# Altium project kbd_training.PrjPcb
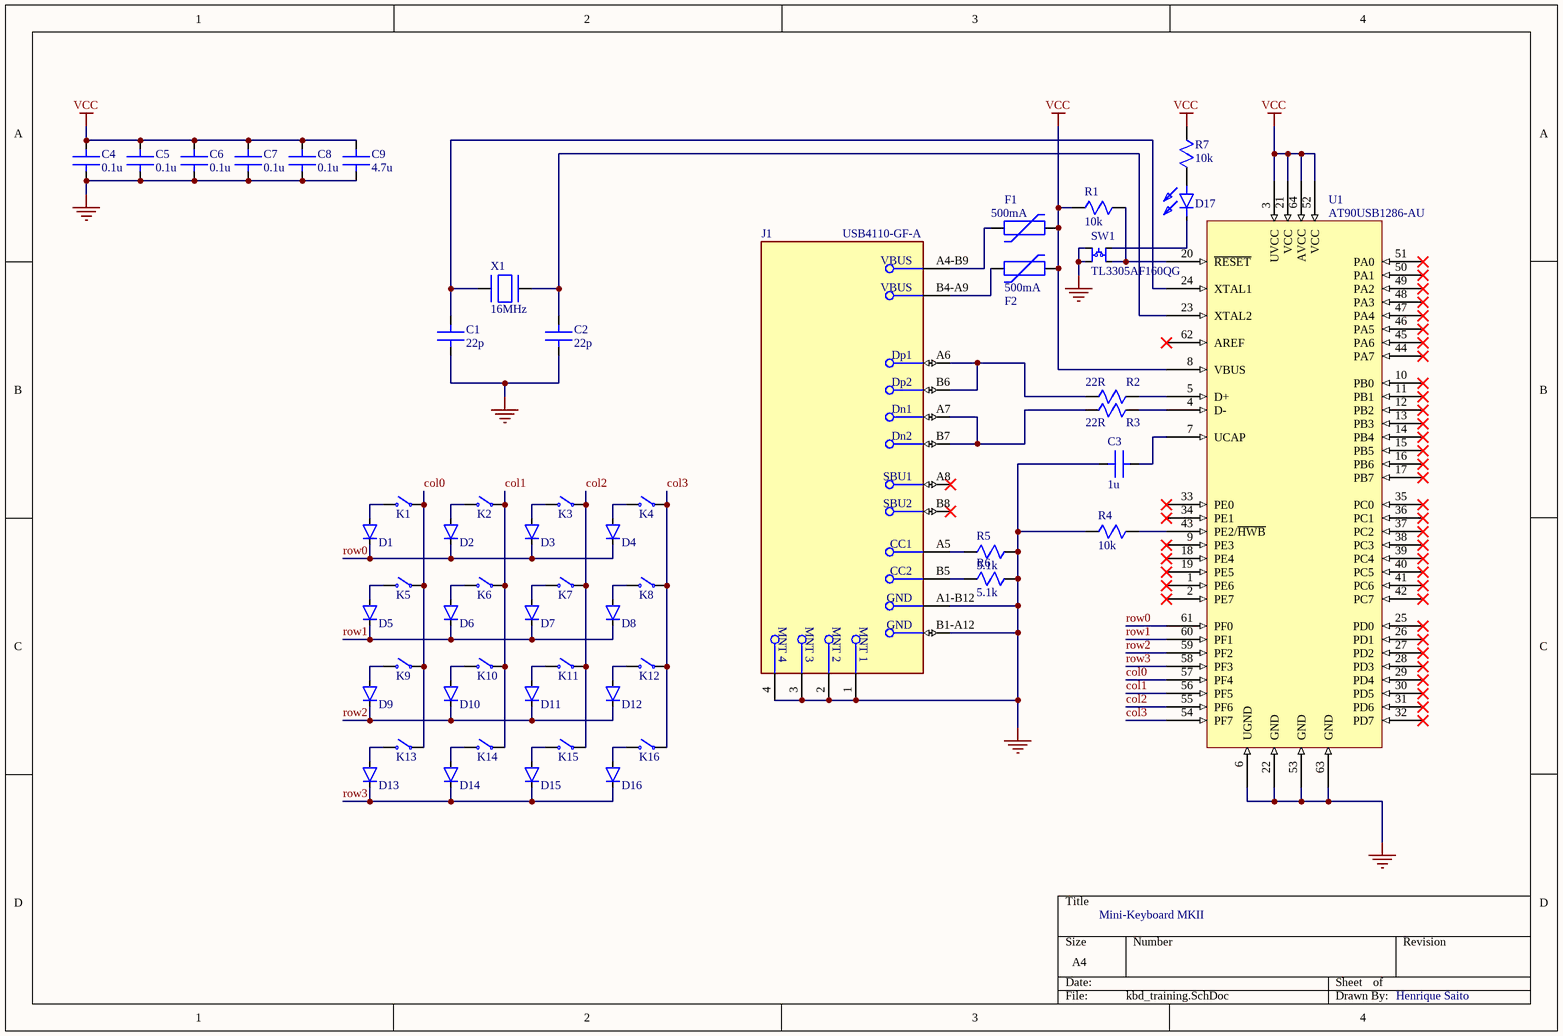
[diagram p0: kbd_training.SchDoc]
1 sheet, 55 parts. Net scope: global (net labels, ports and power ports of the same name join across sheets).
Board file: kbd_training.PcbDoc

## Sheet kbd_training.SchDoc
size A4; SheetNumber: 1; SheetTotal: 1

### Parts
C1  22p  [Cap0805]
C2  22p  [Cap0805]
C3  1u  [Cap0805]
C4  0.1u  [Cap0805]
C5  0.1u  [Cap0805]
C6  0.1u  [Cap0805]
C7  0.1u  [Cap0805]
C8  0.1u  [Cap0805]
C9  4.7u  [Cap0805]
D1  1N4148W-TP  [1N4 diode]  (value not drawn)
D2  1N4148W-TP  [1N4 diode]  (value not drawn)
D3  1N4148W-TP  [1N4 diode]  (value not drawn)
D4  1N4148W-TP  [1N4 diode]  (value not drawn)
D5  1N4148W-TP  [1N4 diode]  (value not drawn)
D6  1N4148W-TP  [1N4 diode]  (value not drawn)
D7  1N4148W-TP  [1N4 diode]  (value not drawn)
D8  1N4148W-TP  [1N4 diode]  (value not drawn)
D9  1N4148W-TP  [1N4 diode]  (value not drawn)
D10  1N4148W-TP  [1N4 diode]  (value not drawn)
D11  1N4148W-TP  [1N4 diode]  (value not drawn)
D12  1N4148W-TP  [1N4 diode]  (value not drawn)
D13  1N4148W-TP  [1N4 diode]  (value not drawn)
D14  1N4148W-TP  [1N4 diode]  (value not drawn)
D15  1N4148W-TP  [1N4 diode]  (value not drawn)
D16  1N4148W-TP  [1N4 diode]  (value not drawn)
D17  WP5603SIDLK/SD/J3  [MT5470EUR]  (value not drawn)
F1  500mA  [FUS0603]
F2  500mA  [FUS0603]
J1  USB4110-GF-A  [GCT_USB4110-GF-A_REVB]
K1  MX1A-11NN  [CHERRY_MX1A-11NN_SWITCH]  (value not drawn)
K2  MX1A-11NN  [CHERRY_MX1A-11NN_SWITCH]  (value not drawn)
K3  MX1A-11NN  [CHERRY_MX1A-11NN_SWITCH]  (value not drawn)
K4  MX1A-11NN  [CHERRY_MX1A-11NN_SWITCH]  (value not drawn)
K5  MX1A-11NN  [CHERRY_MX1A-11NN_SWITCH]  (value not drawn)
K6  MX1A-11NN  [CHERRY_MX1A-11NN_SWITCH]  (value not drawn)
K7  MX1A-11NN  [CHERRY_MX1A-11NN_SWITCH]  (value not drawn)
K8  MX1A-11NN  [CHERRY_MX1A-11NN_SWITCH]  (value not drawn)
K9  MX1A-11NN  [CHERRY_MX1A-11NN_SWITCH]  (value not drawn)
K10  MX1A-11NN  [CHERRY_MX1A-11NN_SWITCH]  (value not drawn)
K11  MX1A-11NN  [CHERRY_MX1A-11NN_SWITCH]  (value not drawn)
K12  MX1A-11NN  [CHERRY_MX1A-11NN_SWITCH]  (value not drawn)
K13  MX1A-11NN  [CHERRY_MX1A-11NN_SWITCH]  (value not drawn)
K14  MX1A-11NN  [CHERRY_MX1A-11NN_SWITCH]  (value not drawn)
K15  MX1A-11NN  [CHERRY_MX1A-11NN_SWITCH]  (value not drawn)
K16  MX1A-11NN  [CHERRY_MX1A-11NN_SWITCH]  (value not drawn)
R1  10k  [Res0805]
R2  22R  [Res0805]
R3  22R  [Res0805]
R4  10k  [Res0805]
R5  5.1k  [Res0805]
R6  5.1k  [Res0805]
R7  10k  [Res0805]
SW1  TL3305AF160QG  [TL3305 SW]
U1  AT90USB1286-AU  [QFP80P1600X1600X120-64N]
X1  16MHz  [xtal-m403]

### Nets
GND: C1.2 C2.2 C3.1 C4.1 C5.1 C6.1 C7.1 C8.1 C9.1 J1.1(MNT_1) J1.2(MNT_2) J1.3(MNT_3) J1.4(MNT_4) J1.A1-B12(GND) J1.B1-A12(GND) R4.1 R5.2 R6.2 SW1.3 SW1.4 U1.6(UGND) U1.22(GND) U1.53(GND) U1.63(GND)
VCC: C4.2 C5.2 C6.2 C7.2 C8.2 C9.2 F1.2 F2.2 R1.1 R7.2 U1.3(UVCC) U1.8(VBUS) U1.21(VCC) U1.52(VCC) U1.64(AVCC)
col0: K1.2 K5.2 K9.2 K13.2 U1.57(PF4)
col1: K2.2 K6.2 K10.2 K14.2 U1.56(PF5)
col2: K3.2 K7.2 K11.2 K15.2 U1.55(PF6)
col3: K4.2 K8.2 K12.2 K16.2 U1.54(PF7)
row0: D1.2 D2.2 D3.2 D4.2 U1.61(PF0)
row1: D5.2 D6.2 D7.2 D8.2 U1.60(PF1)
row2: D9.2 D10.2 D11.2 D12.2 U1.59(PF2)
row3: D13.2 D14.2 D15.2 D16.2 U1.58(PF3)
NetC1_1: C1.1 U1.24(XTAL1) X1.1
NetC2_1: C2.1 U1.23(XTAL2) X1.3
NetC3_2: C3.2 U1.7(UCAP)
NetD1_1: D1.1 K1.1
NetD2_1: D2.1 K2.1
NetD3_1: D3.1 K3.1
NetD4_1: D4.1 K4.1
NetD5_1: D5.1 K5.1
NetD6_1: D6.1 K6.1
NetD7_1: D7.1 K7.1
NetD8_1: D8.1 K8.1
NetD9_1: D9.1 K9.1
NetD10_1: D10.1 K10.1
NetD11_1: D11.1 K11.1
NetD12_1: D12.1 K12.1
NetD13_1: D13.1 K13.1
NetD14_1: D14.1 K14.1
NetD15_1: D15.1 K15.1
NetD16_1: D16.1 K16.1
NetD17_1: D17.1 SW1.2
NetD17_2: D17.2 R7.1
NetF1_1: F1.1 J1.A4-B9(VBUS)
NetF2_1: F2.1 J1.B4-A9(VBUS)
NetJ1_A5: J1.A5(CC1) R5.1
NetJ1_A6: J1.A6(Dp1) J1.B6(Dp2) R2.1
NetJ1_A7: J1.A7(Dn1) J1.B7(Dn2) R3.1
NetJ1_B5: J1.B5(CC2) R6.1
NetR1_2: R1.2 SW1.1 U1.20(~{RESET})
NetR2_2: R2.2 U1.5(D+)
NetR3_2: R3.2 U1.4(D-)
NetR4_2: R4.2 U1.43(PE2/~{HWB})

Not connected (* = marked no-connect by the designer): J1 A8(SBU1)* B8(SBU2)*; U1 1(PE6)* 2(PE7)* 9(PE3)* 10(PB0)* 11(PB1)* 12(PB2)* 13(PB3)* 14(PB4)* 15(PB5)* 16(PB6)* 17(PB7)* 18(PE4)* 19(PE5)* 25(PD0)* 26(PD1)* 27(PD2)* 28(PD3)* 29(PD4)* 30(PD5)* 31(PD6)* 32(PD7)* 33(PE0)* 34(PE1)* 35(PC0)* 36(PC1)* 37(PC2)* 38(PC3)* 39(PC4)* 40(PC5)* 41(PC6)* 42(PC7)* 44(PA7)* 45(PA6)* 46(PA5)* 47(PA4)* 48(PA3)* 49(PA2)* 50(PA1)* 51(PA0)* 62(AREF)*

### Notes on the sheet
- Mini-Keyboard MKII
- Henrique Saito

### Library data of the parts
C1 C2 = C0805C220J5GACTU: Cap Ceramic 22pF 50V C0G 5% SMD 0805 125C Plastic T/R; Manufacturer: KEMET; Temperature Coefficient: 30ppm/°C; Supplier 1: Digi-Key; Manufacturer Part Number: C0805C220J5GACTU; RoHS: Yes; Category: Ceramic Capacitors; Stock 1: 630269; Pricing 1: 1=0.10000, 10=0.06000, 50=0.03300, 100=0.02700, 500=0.01924, 1000=0.01512 (USD); Mount: PCB,Surface Mount; Case/Package: 0805; Case Code (Metric): 2012; Case Code (Imperial): 0805; Weight: 0.000194oz; Contact Material: Tin; Contact Plating: Tin,Matte; Dielectric Material: Ceramic; Min Operating Temperature: -55°C; Max Operating Temperature: 125°C; Packaging: Tape and Reel; Capacitance: 22pF; Tolerance: 5%; Package Quantity: 1; Voltage Rating: 50V; Voltage Rating (DC): 50V; Dielectric: C0G; Termination: SMD/SMT; Voltage: 50V; Series: C0805C; Construction: Flat; Length: 2mm; Width: 1.25mm; Height: 0.78mm; Thickness: 0.035inch; Depth: 1.25mm; Radiation Hardening: No; REACH SVHC: No SVHC; Lead Free: Lead Free; ComponentLink1URL: https://datasheet.ciiva.com/7842/1732694-7842250.pdf?src-supplier=Element14; ComponentLink1Description: https://datasheet.ciiva.com/7842/1732694-7842250.pdf?src-supplier=Element14; ComponentLink2URL: https://datasheet.ciiva.com/7842/1372242-7842570.pdf?src-supplier=Element14; ComponentLink2Description: https://datasheet.ciiva.com/7842/1372242-7842570.pdf?src-supplier=Element14; ComponentLink3URL: https://datasheet.ciiva.com/7842/1732694-7842251.pdf?src-supplier=Element14; ComponentLink3Description: https://datasheet.ciiva.com/7842/1732694-7842251.pdf?src-supplier=Element14; ComponentLink4URL: https://datasheet.ciiva.com/7842/kem-c1003-c0g-smd-7842569.pdf?src-supplier=Element14; ComponentLink4Description: https://datasheet.ciiva.com/7842/kem-c1003-c0g-smd-7842569.pdf?src-supplier=Element14; ComponentLink5URL: https://datasheet.ciiva.com/28668/1789732-28668761.pdf?src-supplier=Element14; ComponentLink5Description: https://datasheet.ciiva.com/28668/1789732-28668761.pdf?src-supplier=Element14; Supplier Part Number 1: 399-C0805C220J5GAC7800CT-ND
C3 = 885012207051: Cap, 1ΜF, 16V, 10%, X7R, 0805; Manufacturer: Wurth Electronics; Capacitance: 1uF; Supplier 1: Digi-Key; Manufacturer Part Number: 885012207051; RoHS: Yes; Category: Ceramic Capacitors; Stock 1: 58540; Pricing 1: 1=0.10000, 10=0.08200, 100=0.07400, 500=0.06500 (USD); Mount: Surface Mount; Case/Package: 0805; Case Code (Metric): 2012; Case Code (Imperial): 0805; Min Operating Temperature: -55°C; Max Operating Temperature: 125°C; Packaging: Tape and Reel; Voltage Rating: 16V; Tolerance: 10%; Length: 0.079inch; Width: 0.049inch; Thickness: 0.053inch; RoHS Compliant: Yes; ComponentLink1URL: http://www.farnell.com/datasheets/2031863.pdf?src-supplier=Farnell; ComponentLink1Description: http://www.farnell.com/datasheets/2031863.pdf?src-supplier=Farnell; ComponentLink2URL: http://www.farnell.com/datasheets/2031863.pdf?src-supplier=Newark; ComponentLink2Description: http://www.farnell.com/datasheets/2031863.pdf?src-supplier=Newark; ComponentLink3URL: http://www.farnell.com/datasheets/2031863.pdf?src-supplier=Element14; ComponentLink3Description: http://www.farnell.com/datasheets/2031863.pdf?src-supplier=Element14; ComponentLink4URL: https://katalog.we-online.de/pbs/datasheet/885012207051.pdf?src-supplier=Digi-Key; ComponentLink4Description: https://katalog.we-online.de/pbs/datasheet/885012207051.pdf?src-supplier=Digi-Key; Supplier Part Number 1: 732-7664-1-ND
C4-C8 = CC0805ZRY5V9BB104: Cap Ceramic 0.1uF 50V Y5V -20% to 80% SMD 0805 85C T/R; Manufacturer: Yageo; Capacitance: 100nF; Supplier 1: Digi-Key; Manufacturer Part Number: CC0805ZRY5V9BB104; RoHS: Yes; Category: Ceramic Capacitors; Stock 1: 957069; Pricing 1: 1=0.10000, 10=0.06700, 50=0.03640, 100=0.02960, 500=0.02118, 1000=0.01664 (USD); Mount: Surface Mount; Case/Package: 0805; Number of Pins: 2; Case Code (Metric): 2012; Case Code (Imperial): 0805; Material: Ceramic; Dielectric Material: Ceramic; Min Operating Temperature: -30°C; Max Operating Temperature: 85°C; Package Quantity: 1; Voltage Rating: 50V; Tolerance: 80%; Packaging: Tape and Reel; Voltage Rating (DC): 50V; Dielectric: Y5V; Termination: SMD/SMT; Resistor Type: Ceramic; Series: CC; Construction: Flat; Length: 2mm; Width: 0.049inch; Height: 0.6mm; Thickness: 0.024inch; Depth: 1.25mm; Radiation Hardening: No; REACH SVHC: No SVHC; Lead Free: Lead Free; Halogen Free: Halogen Free; RoHS Compliant: Yes; ComponentLink1URL: https://datasheet.ciiva.com/28450/1132289-28450870.pdf?src-supplier=Element14; ComponentLink1Description: https://datasheet.ciiva.com/28450/1132289-28450870.pdf?src-supplier=Element14; ComponentLink2URL: https://datasheet.ciiva.com/144/mlccorderingcode-144210.pdf?src-supplier=Digi-Key; ComponentLink2Description: https://datasheet.ciiva.com/144/mlccorderingcode-144210.pdf?src-supplier=Digi-Key; ComponentLink3URL: https://datasheet.ciiva.com/144/mlccorderingcode-144209.pdf?src-supplier=Digi-Key; ComponentLink3Description: https://datasheet.ciiva.com/144/mlccorderingcode-144209.pdf?src-supplier=Digi-Key; ComponentLink4URL: https://datasheet.ciiva.com/144/mlccorderingcode-144211.pdf?src-supplier=Digi-Key; ComponentLink4Description: https://datasheet.ciiva.com/144/mlccorderingcode-144211.pdf?src-supplier=Digi-Key; ComponentLink5URL: https://datasheet.ciiva.com/13389/upy-gp-np0-16v-to-50v-8-13389351.pdf?src-supplier=Mouser; ComponentLink5Description: https://datasheet.ciiva.com/13389/upy-gp-np0-16v-to-50v-8-13389351.pdf?src-supplier=Mouser; ComponentLink6URL: https://datasheet.ciiva.com/11465/upy-gphc-y5v-6-3v-to-50v-5-11465865.pdf?src-supplier=Avnet; ComponentLink6Description: https://datasheet.ciiva.com/11465/upy-gphc-y5v-6-3v-to-50v-5-11465865.pdf?src-supplier=Avnet; ComponentLink7URL: https://datasheet.ciiva.com/16747/upy-gphc-y5v-6-3v-to-50v-5-revised-16747323.pdf?src-supplier=Future+Electronics; ComponentLink7Description: https://datasheet.ciiva.com/16747/upy-gphc-y5v-6-3v-to-50v-5-revised-16747323.pdf?src-supplier=Future+Electronics; ComponentLink8URL: https://datasheet.ciiva.com/15189/getdatasheetpartid-55882-15189238.pdf?src-supplier=Verical; ComponentLink8Description: https://datasheet.ciiva.com/15189/getdatasheetpartid-55882-15189238.pdf?src-supplier=Verical; ComponentLink9URL: https://datasheet.ciiva.com/29241/445331-da-01-en-kerko-chip-0805-y5v0-1uf-20-80proz50vg-29241946.pdf?src-supplier=Conrad; ComponentLink9Description: https://datasheet.ciiva.com/29241/445331-da-01-en-kerko-chip-0805-y5v0-1uf-20-80proz50vg-29241946.pdf?src-supplier=Conrad; Supplier Part Number 1: 311-1361-1-ND
C9 = CL21A475KPFNNNE: Cap Ceramic 4.7uF 10V X5R 10% SMD 0805 85C T/R; Manufacturer: Samsung; Supplier 1: Digi-Key; Manufacturer Part Number: CL21A475KPFNNNE; RoHS: Yes; Category: Ceramic Capacitors; Stock 1: 1032476; Pricing 1: 1=0.10000, 10=0.07500, 50=0.04060, 100=0.03320, 500=0.02372, 1000=0.01863 (USD); Mount: Surface Mount; Case/Package: 0805; Case Code (Metric): 2012; Case Code (Imperial): 0805; Contact Plating: Tin; Min Operating Temperature: -55°C; Max Operating Temperature: 85°C; Package Quantity: 1; Packaging: Tape and Reel; Capacitance: 4.7uF; Tolerance: 10%; Voltage Rating: 10V; Dielectric: X5R; Voltage Rating (DC): 10V; Series: CL; Construction: Flat; Length: 2mm; Width: 0.049inch; Height: 1.25mm; Thickness: 0.053inch; Depth: 1.25mm; Radiation Hardening: No; Lead Free: Lead Free; RoHS Compliant: Yes; ComponentLink1URL: https://datasheet.ciiva.com/25766/cl21a475kpfnnne-25766898.pdf?src-supplier=Digi-Key; ComponentLink1Description: https://datasheet.ciiva.com/25766/cl21a475kpfnnne-25766898.pdf?src-supplier=Digi-Key; ComponentLink2URL: https://datasheet.ciiva.com/15216/getdatasheetpartid-358357-15216235.pdf?src-supplier=Verical; ComponentLink2Description: https://datasheet.ciiva.com/15216/getdatasheetpartid-358357-15216235.pdf?src-supplier=Verical; ComponentLink3URL: https://datasheet.ciiva.com/26310/mlcc-catalogdownload2013-eng-26310173.pdf?src-supplier=Distrelec; ComponentLink3Description: https://datasheet.ciiva.com/26310/mlcc-catalogdownload2013-eng-26310173.pdf?src-supplier=Distrelec; ComponentLink4URL: https://datasheet.ciiva.com/16374/cl05b104kq5nnnc-16374138.pdf?src-supplier=Future+Electronics; ComponentLink4Description: https://datasheet.ciiva.com/16374/cl05b104kq5nnnc-16374138.pdf?src-supplier=Future+Electronics; Supplier Part Number 1: 1276-1259-1-ND
D1-D16 = 1N4148W-TP: VR=100V IF=300mA Trr=4ns P=400mW; Manufacturer: MCC; Max Surge Current: 2A; Forward Voltage: 1V; Forward Current: 150mA; Recovery Time: 4ns; Max Reverse Leakage Current: 5uA; Max Repetitive Reverse Voltage (Vrrm): 100V; Power Dissipation: 400mW; Max Forward Surge Current (Ifsm): 1A; Element Configuration: Single; Polarity: Standard; Capacitance: 4pF; Supplier 1: Digi-Key; Manufacturer Part Number: 1N4148W-TP; RoHS: Yes; Category: Rectifier Diodes; Stock 1: 5873694; Pricing 1: 1=0.19000, 10=0.17300, 100=0.09440, 500=0.05808, 1000=0.03960 (USD); Mount: Surface Mount; Number of Pins: 2; Min Operating Temperature: -65°C; Max Operating Temperature: 150°C; Packaging: Tape and Reel; Package Quantity: 3000; Average Rectified Current: 150mA; Reverse Recovery Time: 4ns; Peak Non-Repetitive Surge Current: 2A; Voltage Rating (DC): 100V; Current Rating: 150mA; Output Current: 150mA; Max Reverse Voltage (DC): 100V; Series: 1N4148; Reverse Recovery Time-Max: 4ns; Length: 2.85mm; Width: 1.8mm; Height: 1.2mm; Radiation Hardening: No; REACH SVHC: Unknown; Lead Free: Lead Free; RoHS Compliant: Yes; ComponentLink1URL: https://datasheet.ciiva.com/16836/1n4148wsod123-16836277.pdf?src-supplier=Future+Electronics; ComponentLink1Description: https://datasheet.ciiva.com/16836/1n4148wsod123-16836277.pdf?src-supplier=Future+Electronics; ComponentLink2URL: https://datasheet.ciiva.com/1243/1684829-1243908.pdf?src-supplier=Newark; ComponentLink2Description: https://datasheet.ciiva.com/1243/1684829-1243908.pdf?src-supplier=Newark; ComponentLink3URL: https://datasheet.ciiva.com/4435/1n4148wsod123-48460-4435223.pdf?src-supplier=Mouser; ComponentLink3Description: https://datasheet.ciiva.com/4435/1n4148wsod123-48460-4435223.pdf?src-supplier=Mouser; ComponentLink4URL: https://datasheet.ciiva.com/7622/1684829-7622556.pdf?src-supplier=Element14; ComponentLink4Description: https://datasheet.ciiva.com/7622/1684829-7622556.pdf?src-supplier=Element14; ComponentLink5URL: https://datasheet.ciiva.com/911/1n4148wsod123-911677.pdf?src-supplier=Digi-Key; ComponentLink5Description: https://datasheet.ciiva.com/911/1n4148wsod123-911677.pdf?src-supplier=Digi-Key; ComponentLink6URL: https://datasheet.ciiva.com/911/1n4148wsod123-911678.pdf?src-supplier=Digi-Key; ComponentLink6Description: https://datasheet.ciiva.com/911/1n4148wsod123-911678.pdf?src-supplier=Digi-Key; ComponentLink7URL: https://datasheet.ciiva.com/911/1n4148wsod123-911676.pdf?src-supplier=Digi-Key; ComponentLink7Description: https://datasheet.ciiva.com/911/1n4148wsod123-911676.pdf?src-supplier=Digi-Key; ComponentLink8URL: https://datasheet.ciiva.com/22747/1684829-22747439.pdf?src-supplier=Element14; ComponentLink8Description: https://datasheet.ciiva.com/22747/1684829-22747439.pdf?src-supplier=Element14; ComponentLink9URL: https://datasheet.ciiva.com/14557/70055519-14557767.pdf?src-supplier=Allied+Electronics; ComponentLink9Description: https://datasheet.ciiva.com/14557/70055519-14557767.pdf?src-supplier=Allied+Electronics; Supplier Part Number 1: 1N4148WTPMSCT-ND
D17 = WP5603SIDLK/SD/J3: LED Uni-Color Hyper Red 640nm 2-Pin Bulk; Manufacturer: Kingbright; Lens Style: Elliptical,Domed; Lens Transparency: Diffused; Luminous Intensity: 2400mcd; Forward Voltage: 2.2V; Test Current: 20mA; Viewing Angle: 40°; Dominant Wavelength: 625nm; Lens Size: 3.8mm; Supplier 1: Digi-Key; Manufacturer Part Number: WP5603SIDLK/SD/J3; RoHS: Yes; Category: LEDs; Stock 1: 11905; Pricing 1: 1=0.68000, 10=0.42000, 100=0.24140, 1000=0.18889, 2000=0.17315, 5000=0.15741, 10000=0.14850 (USD); Mount: Through Hole; Case/Package: Radial; Color: Red; Lens Color: Red; Packaging: Bulk; Height: 7.25mm; RoHS Compliant: Yes; ComponentLink1URL: http://www.kingbrightusa.com/images/catalog/SPEC/WP5603SIDLK-SD-J3.pdf?src-supplier=Digi-Key; ComponentLink1Description: http://www.kingbrightusa.com/images/catalog/SPEC/WP5603SIDLK-SD-J3.pdf?src-supplier=Digi-Key; Supplier Part Number 1: 754-2132-ND
F1 F2 = ERBRD0R50X: Fuse Chip Fast Acting 0.5A 32V SMD Solder Pad 0402 1 X 0.5 X 0.39mm T/R UL/cUL; Manufacturer: Panasonic; Body Material: Alumina; DC Cold Resistance: 310mR; Fuse Type: Board Mount (Cartridge Style Excluded); Fuse Size: 1 X 0.5mm; Approvals: UL; Supplier 1: Digi-Key; Manufacturer Part Number: ERBRD0R50X; RoHS: Yes; Category: Fuses; Stock 1: 6080; Pricing 1: 1=0.27000, 5=0.26400, 10=0.25300, 50=0.22540, 100=0.20980, 250=0.18648, 500=0.15540, 1000=0.14763, 5000=0.11655 (USD); Mount: Surface Mount; Case/Package: 0402; Number of Pins: 2; Case Code (Metric): 1005; Case Code (Imperial): 0402; Min Operating Temperature: -40°C; Max Operating Temperature: 125°C; Packaging: Tape and Reel; Current Rating: 500mA; Voltage Rating (DC): 32V; Package Quantity: 10000; Max Voltage Rating (DC): 32V; Voltage Rating: 32V; Current: 500mA; Fuse Current: 500mA; Series: ERB-RD; Length: 1mm; Width: 0.5mm; Height: 0.39mm; REACH SVHC: No SVHC; RoHS Compliant: Yes; ComponentLink1URL: https://datasheet.ciiva.com/25619/0900766b810c2f76-25619805.pdf?src-supplier=RSComponents; ComponentLink1Description: https://datasheet.ciiva.com/25619/0900766b810c2f76-25619805.pdf?src-supplier=RSComponents; ComponentLink2URL: https://datasheet.ciiva.com/46392/1328695-46392479.pdf?src-supplier=Element14; ComponentLink2Description: https://datasheet.ciiva.com/46392/1328695-46392479.pdf?src-supplier=Element14; ComponentLink3URL: https://datasheet.ciiva.com/5813/1328695-5813610.pdf?src-supplier=Farnell; ComponentLink3Description: https://datasheet.ciiva.com/5813/1328695-5813610.pdf?src-supplier=Farnell; ComponentLink4URL: https://datasheet.ciiva.com/24088/panasonic-afa0000ce6-327311-24088239.pdf?src-supplier=Mouser; ComponentLink4Description: https://datasheet.ciiva.com/24088/panasonic-afa0000ce6-327311-24088239.pdf?src-supplier=Mouser; ComponentLink5URL: https://datasheet.ciiva.com/299/afa0000ce6-299063.pdf?src-supplier=Digi-Key; ComponentLink5Description: https://datasheet.ciiva.com/299/afa0000ce6-299063.pdf?src-supplier=Digi-Key; ComponentLink6URL: https://datasheet.ciiva.com/299/afa0000ce6-299064.pdf?src-supplier=Digi-Key; ComponentLink6Description: https://datasheet.ciiva.com/299/afa0000ce6-299064.pdf?src-supplier=Digi-Key; ComponentLink7URL: https://datasheet.ciiva.com/299/afa0000ce6-299062.pdf?src-supplier=Digi-Key; ComponentLink7Description: https://datasheet.ciiva.com/299/afa0000ce6-299062.pdf?src-supplier=Digi-Key; Supplier Part Number 1: P15122CT-ND
J1 = CMP-245163-000002-1: CONN USB 2.0 TYPE-C R/A SMT; Manufacturer: GCT; Conn Orientation: Right Angle; Usb Standard: USB 2.0; Voltage Rating: 20V; Current Rating: 3/4.25/1.25/0.25A; Number Of Contacts: 16; Is Female: yes; Shielding: true; Standoff Height: 0.1mm; Octopart: https://octopart.com/usb4110-gf-a-gct-103941985; Temperature: -40°C to +85°C; RoHS: TRUE; Automotive: No; Contact Material: Gold,Nickel; Device Class L1: Connectors; Device Class L2: USB Connectors; Package: 0; Lead Free: Yes; ComponentLink2URL: https://gct.co/files/drawings/usb4110.pdf; Temperature Range High: +85°C; Temperature Range Low: -40°C; Height: 3.46mm; Manufacturer Part Number: USB4110-GF-A; ComponentLink2Description: Datasheet; Device Class L3: unset; Digikey Description: CONN USB 2.0 TYPE-C R/A SMT; Category: Conn
K1-K16 = MX1A-11NN: Switch Key N.O. SPST 0.01A 12VAC 12VDC 0.58N PC Pins 50000000Cycles Thru-Hole; Manufacturer: Cherry; Number of Terminals/Pins: 2; Contact Current Rating: 10mA; Voltage Rating (AC): 12V; Contact Resistance: 200mR; Operating Force: 60N; Illumination Type: Illuminated; Insulation Resistance: 100MR; Switch Function: Off-Mom; Life (Hours): 50000000Hour; Actuator Type: PLUNGER; Row Spacing: 6.35mm; Actuator Length: 3.6mm; Ratings: IP40; Supplier 1: Digi-Key; Manufacturer Part Number: MX1A-11NN; RoHS: Yes; Category: Pushbutton Switches; Stock 1: 12102; Pricing 1: 1=0.99000, 10=0.88600, 25=0.84080, 50=0.79980, 100=0.76230, 250=0.72872, 500=0.65398, 1000=0.61660 (USD); Mount: Panel,Front,Through Hole,PCB; Case/Package: Module; Number of Pins: 2; Contact Material: Gold,Silver; Contact Plating: Gold; Housing Material: Thermoplastic; Min Operating Temperature: -10°C; Max Operating Temperature: 70°C; Voltage Rating (DC): 12V; Throw Configuration: SPST; Max Current Rating: 10mA; Current Rating: 10mA; Max Voltage Rating (AC): 12V; Max Voltage Rating (DC): 12V; Package Quantity: 1000; Packaging: Bulk; Termination: PC Pin; Life (Cycles): 50000000Cycles; Electrical Life: 50000000Cycles; Switching Current: 10mA; Orientation: Straight; Series: MX; Contact Type: 1 maker; Length: 15.6mm; Width: 15.6mm; Terminal Pitch: 2.54mm; REACH SVHC: No SVHC; Lead Free: Lead Free; Flammability Rating: UL94 HB; RoHS Compliant: Yes; ComponentLink1URL: https://datasheet.ciiva.com/7637/1792245-7637139.pdf?src-supplier=Element14; ComponentLink1Description: https://datasheet.ciiva.com/7637/1792245-7637139.pdf?src-supplier=Element14; ComponentLink2URL: https://datasheet.ciiva.com/29188/706315-da-01-de-tastenmodul-mx1a-11nn-0-01a-12v-29188125.pdf?src-supplier=Conrad; ComponentLink2Description: https://datasheet.ciiva.com/29188/706315-da-01-de-tastenmodul-mx1a-11nn-0-01a-12v-29188125.pdf?src-supplier=Conrad; ComponentLink3URL: https://datasheet.ciiva.com/2869/mxseries-2869565.pdf?src-supplier=Digi-Key; ComponentLink3Description: https://datasheet.ciiva.com/2869/mxseries-2869565.pdf?src-supplier=Digi-Key; ComponentLink4URL: https://datasheet.ciiva.com/14542/70207618-14542184.pdf?src-supplier=Allied+Electronics; ComponentLink4Description: https://datasheet.ciiva.com/14542/70207618-14542184.pdf?src-supplier=Allied+Electronics; Supplier Part Number 1: CH162-ND
R1 R4 R7 = RMCF0805JT10K0: Res Thick Film 0805 10K Ohm 5% 0.125W(1/8W) ±200ppm/C Pad SMD Automotive T/R; Manufacturer: Stackpole Electronics; Resistance: 10kR; Power Rating: 125mW; Temperature Coefficient: 100ppm/°C; Supplier 1: Digi-Key; Manufacturer Part Number: RMCF0805JT10K0; RoHS: Yes; Category: Chip SMD Resistors; Stock 1: 1086026; Pricing 1: 1=0.10000, 10=0.02000, 100=0.00810, 1000=0.00366, 2500=0.00318 (USD); Mount: Surface Mount; Case/Package: 0805; Case Code (Metric): 2012; Case Code (Imperial): 0805; Contact Plating: Tin,Matte; Size Code: 0805; Min Operating Temperature: -55°C; Max Operating Temperature: 155°C; Packaging: Tape and Reel; Tolerance: 5%; Resistor Type: Thick Film; Number of Terminations: 2; Max Power Dissipation: 125mW; Features: Automotive AEC-Q200; Series: RMCF; Construction: Rectangular; Length: 2mm; Width: 0.049inch; Height: 0.026inch; Depth: 1.25mm; Radiation Hardening: No; Military Standard: Not; Lead Free: Lead Free; RoHS Compliant: Yes; ComponentLink1URL: https://datasheet.ciiva.com/15193/getdatasheetpartid-363745-15193627.pdf?src-supplier=Verical; ComponentLink1Description: https://datasheet.ciiva.com/15193/getdatasheetpartid-363745-15193627.pdf?src-supplier=Verical; Supplier Part Number 1: RMCF0805JT10K0CT-ND
R2 R3 = CR0805-FX-22R0ELF: Res Thick Film 0805 22 Ohm 1% 1/8W 100ppm/C Molded SMD SMD Paper Tape on Plastic Reel; Manufacturer: Bourns; Power Rating: 125mW; Voltage Rating: 150V; Temperature Coefficient: 100ppm/°C; Supplier 1: Digi-Key; Manufacturer Part Number: CR0805-FX-22R0ELF; RoHS: Yes; Category: Chip SMD Resistors; Stock 1: 13859; Pricing 1: 1=0.10000, 10=0.05000, 100=0.02040, 1000=0.00914, 2500=0.00794 (USD); Mount: Surface Mount; Case/Package: 0805; Case Code (Imperial): 0805; Case Code (Metric): 2012; Contact Plating: Tin; Min Operating Temperature: -55°C; Max Operating Temperature: 155°C; Resistance: 22R; Tolerance: 1%; Packaging: Tape and Reel; Package Quantity: 5000; Resistor Type: Thick Film; Termination: SMD/SMT; Number of Terminations: 2; Max Power Dissipation: 125mW; Features: Moisture Resistant; Series: CR0805; Construction: Rectangular; Length: 2mm; Width: 1.25mm; Height: 0.024inch; Depth: 1.25mm; Thickness: 508um; Radiation Hardening: No; Military Standard: Not; RoHS Compliant: Yes; ComponentLink1URL: https://datasheet.ciiva.com/9121/chpreztr-9121853.pdf?src-supplier=Avnet; ComponentLink1Description: https://datasheet.ciiva.com/9121/chpreztr-9121853.pdf?src-supplier=Avnet; ComponentLink2URL: https://datasheet.ciiva.com/14985/chpreztr-14985915.pdf?src-supplier=Digi-Key; ComponentLink2Description: https://datasheet.ciiva.com/14985/chpreztr-14985915.pdf?src-supplier=Digi-Key; Supplier Part Number 1: CR0805-FX-22R0ELFCT-ND
R5 R6 = ESR10EZPJ512: Res Thick Film 0805 5.1K Ohm 5% 2/5W ±200ppm/°C Molded SMD SMD Paper T/R; Manufacturer: Rohm; Resistance: 5.1kR; Max Power Dissipation: 400mW; Supplier 1: Digi-Key; Manufacturer Part Number: ESR10EZPJ512; RoHS: Yes; Category: Chip SMD Resistors; Stock 1: 4978; Pricing 1: 1=0.10000, 10=0.09000, 100=0.03450, 1000=0.01518, 2500=0.01311 (USD); Case/Package: 0805; Case Code (Metric): 2012; Case Code (Imperial): 0805; Contact Plating: Tin; Min Operating Temperature: -55°C; Max Operating Temperature: 155°C; Tolerance: 5%; Package Quantity: 1; Packaging: Tape and Reel; Resistor Type: Thick Film; Number of Terminations: 2; Temperature Coefficient: 200ppm/°C; Features: Automotive AEC-Q200; Series: ESR; Length: 0.079inch; Width: 0.049inch; Height: 0.026inch; RoHS Compliant: Yes; ComponentLink1URL: https://datasheet.ciiva.com/2515/esr-2515938.pdf?src-supplier=Digi-Key; ComponentLink1Description: https://datasheet.ciiva.com/2515/esr-2515938.pdf?src-supplier=Digi-Key; ComponentLink2URL: https://datasheet.ciiva.com/2515/esr-2515939.pdf?src-supplier=Digi-Key; ComponentLink2Description: https://datasheet.ciiva.com/2515/esr-2515939.pdf?src-supplier=Digi-Key; ComponentLink3URL: https://datasheet.ciiva.com/2515/esr-2515940.pdf?src-supplier=Digi-Key; ComponentLink3Description: https://datasheet.ciiva.com/2515/esr-2515940.pdf?src-supplier=Digi-Key; Supplier Part Number 1: RHM5.1KKCT-ND
SW1 = TL3305AF160QG: TL3305A Series SPST 12 V 4.5 x 4.5 mm 160 gf Top Actuated SMT Tactile Switch; Manufacturer: E-Switch; Mechanical Life: 500000Cycles; Illumination Type: Non-Illuminated; Operating Force: 160gf; Switch Travel: 0.2mm; Switch Function: Off-Mom; Actuator Type: Standard; Supplier 1: Digi-Key; Manufacturer Part Number: TL3305AF160QG; RoHS: Yes; Category: Tactile Switches; Stock 1: 28654; Pricing 1: 1=0.21000, 10=0.19900, 25=0.18880, 100=0.17170, 250=0.16140, 500=0.14766, 1000=0.12362 (USD); Mount: Surface Mount; Min Operating Temperature: -20°C; Max Operating Temperature: 70°C; Packaging: Tape and Reel; Termination: Gull Wing; Throw Configuration: SPST; Lead Free: Lead Free; RoHS Compliant: Yes; ComponentLink1URL: http://www.farnell.com/datasheets/2554191.pdf?src-supplier=Farnell; ComponentLink1Description: http://www.farnell.com/datasheets/2554191.pdf?src-supplier=Farnell; ComponentLink2URL: http://www.farnell.com/datasheets/2554191.pdf?src-supplier=Newark; ComponentLink2Description: http://www.farnell.com/datasheets/2554191.pdf?src-supplier=Newark; ComponentLink3URL: http://spec_sheets.e-switch.com/specs/P010468.pdf?src-supplier=Digi-Key; ComponentLink3Description: http://spec_sheets.e-switch.com/specs/P010468.pdf?src-supplier=Digi-Key; Supplier Part Number 1: EG5350CT-ND
U1 = AT90USB1286-AU: AT90 Series 128 KB Flash 8 kB SRAM 16 MHz 8-Bit Microcontroller - TQFP-64; Manufacturer: Microchip; Supplier 1: Mouser; Manufacturer Part Number: AT90USB1286-AU; RoHS: Yes; Category: Microcontrollers; Stock 1: 3; Pricing 1: 1=10.81000, 10=10.81000, 25=9.92000, 50=9.92000, 90=9.72000, 100=9.72000, 1000=9.72000, 10000=9.72000 (USD); Case/Package: TQFP; RoHS Compliant: Yes; ComponentLink1URL: http://www.farnell.com/datasheets/2048476.pdf?src-supplier=Farnell; ComponentLink1Description: http://www.farnell.com/datasheets/2048476.pdf?src-supplier=Farnell; ComponentLink2URL: http://ww1.microchip.com/downloads/en/DeviceDoc/7593S.pdf?src-supplier=Digi-Key; ComponentLink2Description: http://ww1.microchip.com/downloads/en/DeviceDoc/7593S.pdf?src-supplier=Digi-Key; Supplier Part Number 1: 556-AT90USB1286-AU
X1 = 403I35D16M00000: Crystal 16MHz ±30ppm (Tol) ±50ppm (Stability) 18pF FUND 80Ohm 4-Pin SMD T/R; Manufacturer: CTS; ESR (Equivalent Series Resistance): 80R; Supplier 1: Digi-Key; Manufacturer Part Number: 403I35D16M00000; RoHS: Yes; Category: Crystals; Stock 1: 79; Pricing 1: 1=0.76000, 10=0.66900, 50=0.62540, 100=0.55270, 500=0.52358, 1000=0.43632 (USD); Mount: Surface Mount; Case/Package: CSMD; Number of Pins: 4; Contact Plating: Gold; Min Operating Temperature: -40°C; Max Operating Temperature: 85°C; Packaging: Tape and Reel; Frequency Tolerance: 30ppm; Load Capacitance: 18pF; Package Quantity: 3000; Frequency: 16MHz; Tolerance: 30ppm; Frequency Stability: 50ppm; Termination: SMD/SMT; Series Resistance: 80R; Series: 403; Length: 3.2mm; Width: 2.5mm; Height: 0.031inch; Depth: 2.5mm; Radiation Hardening: No; Lead Free: Lead Free; RoHS Compliant: Yes; ComponentLink1URL: https://datasheet.ciiva.com/26909/getdatasheetpartid-501306-26909962.pdf?src-supplier=Verical; ComponentLink1Description: https://datasheet.ciiva.com/26909/getdatasheetpartid-501306-26909962.pdf?src-supplier=Verical; ComponentLink2URL: https://datasheet.ciiva.com/861/008-0288-0-f-861390.pdf?src-supplier=Digi-Key; ComponentLink2Description: https://datasheet.ciiva.com/861/008-0288-0-f-861390.pdf?src-supplier=Digi-Key; ComponentLink3URL: https://datasheet.ciiva.com/29630/008-0288-0-f-29630970.pdf?src-supplier=Digi-Key; ComponentLink3Description: https://datasheet.ciiva.com/29630/008-0288-0-f-29630970.pdf?src-supplier=Digi-Key; ComponentLink4URL: https://datasheet.ciiva.com/29630/008-0288-0-f-29630972.pdf?src-supplier=Digi-Key; ComponentLink4Description: https://datasheet.ciiva.com/29630/008-0288-0-f-29630972.pdf?src-supplier=Digi-Key; ComponentLink5URL: https://datasheet.ciiva.com/29630/008-0288-0-f-29630971.pdf?src-supplier=Digi-Key; ComponentLink5Description: https://datasheet.ciiva.com/29630/008-0288-0-f-29630971.pdf?src-supplier=Digi-Key; ComponentLink6URL: https://datasheet.ciiva.com/29894/008-0288-0-f-29894534.pdf?src-supplier=Avnet; ComponentLink6Description: https://datasheet.ciiva.com/29894/008-0288-0-f-29894534.pdf?src-supplier=Avnet